# Altium schematic sheet Connecteurs.SchDoc: Connecteurs
size A4; ApprovedBy: Baptiste GADEBILLE; CheckedBy: Baptiste GADEBILLE; Author: Clément MANANT; DrawnBy: Clément MANANT; Revision: V1.0 Rev A; SheetNumber: 3; SheetTotal: 5
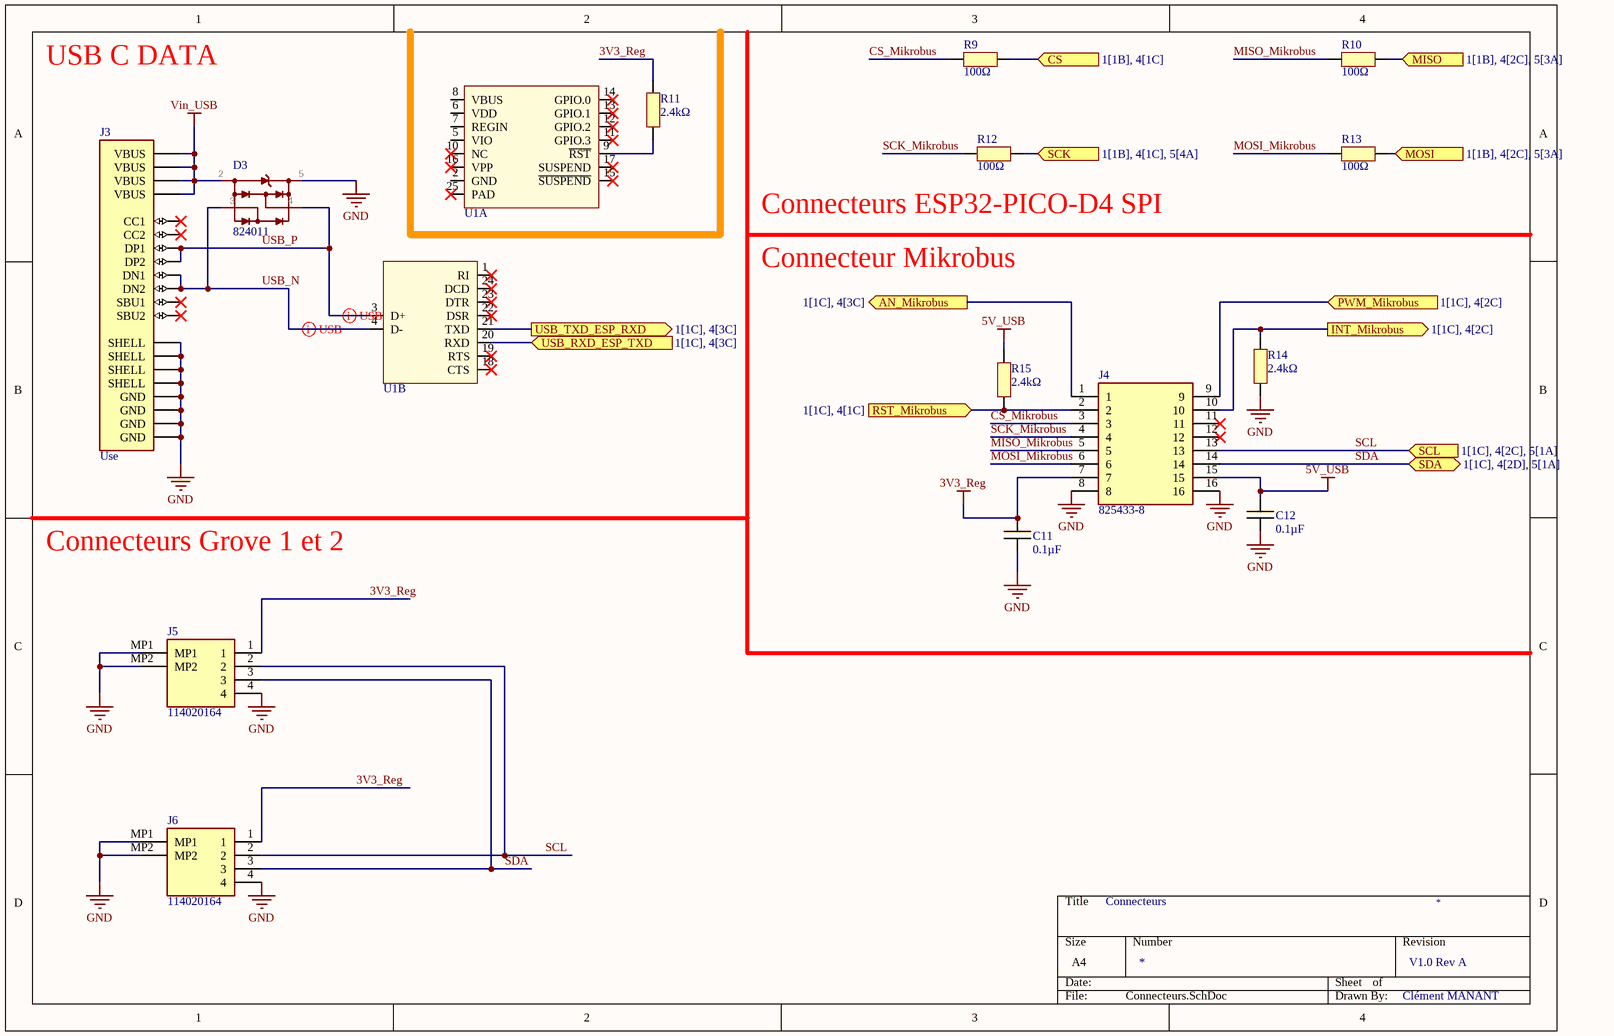
[diagram p0: Connecteurs.SchDoc]

## Parts
C11  0.1µF  [CAPC1005X06N]
C12  0.1µF  [CAPC1005X06N]
D3  824011  [824011]
J3  Use  [USB4085-GF-A]
J4  825433-8  [Connect-Mikronus]
J5  114020164  [114020164]
J6  114020164  [114020164]
R9  100Ω  [RESC1005X06N]
R10  100Ω  [RESC1005X06N]
R11  2.4kΩ  [RESC1005X06N]
R12  100Ω  [RESC1005X06N]
R13  100Ω  [RESC1005X06N]
R14  2.4kΩ  [RESC1005X06N]
R15  2.4kΩ  [RESC1005X06N]
U1  CP2104-F03-GM  [PQFN50P400X400X80_HS-25N]  (value not drawn)  (parts A,B of 2)

## Ports
AN_Mikrobus (out, see 1[1C], 4[3C]), CS (in, see 1[1B], 4[1C]), INT_Mikrobus (out, see 1[1C], 4[2C]), MISO (in, see 1[1B], 4[2C], 5[3A]), MOSI (in, see 1[1B], 4[2C], 5[3A]), PWM_Mikrobus (in, see 1[1C], 4[2C]), RST_Mikrobus (in, see 1[1C], 4[1C]), SCK (in, see 1[1B], 4[1C], 5[4A]), SCL (in, see 1[1C], 4[2C], 5[1A]), SDA (bidir, see 1[1C], 4[2D], 5[1A]), USB_RXD_ESP_TXD (in, see 1[1C], 4[3C]), USB_TXD_ESP_RXD (out, see 1[1C], 4[3C])

## Nets
3V3_Reg: C11.1 J4.7 J5.1 J6.1 R11.2
5V_USB: C12.1 J4.15 R15.2
GND: C11.2 C12.2 D3.5(VDD) J3.A1(GND) J3.A12(GND) J3.B1(GND) J3.B12(GND) J3.S1(SHELL) J3.S2(SHELL) J3.S3(SHELL) J3.S4(SHELL) J4.8 J4.16 J5.4 J5.MP1 J5.MP2 J6.4 J6.MP1 J6.MP2 R14.1
Vin_USB: D3.2(GND) J3.A4(VBUS) J3.A9(VBUS) J3.B4(VBUS) J3.B9(VBUS)
AN_Mikrobus: J4.1 ; port AN_Mikrobus
CS: R9.2 ; port CS
CS_Mikrobus: J4.3 R9.1
INT_Mikrobus: J4.10 R14.2 ; port INT_Mikrobus
MISO: R10.2 ; port MISO
MISO_Mikrobus: J4.5 R10.1
MOSI: R13.2 ; port MOSI
MOSI_Mikrobus: J4.6 R13.1
PWM_Mikrobus: J4.9 ; port PWM_Mikrobus
RST_Mikrobus: J4.2 R15.1 ; port RST_Mikrobus
SCK: R12.2 ; port SCK
SCK_Mikrobus: J4.4 R12.1
SCL: J4.13 J5.2 J6.2 ; port SCL
SDA: J4.14 J5.3 J6.3 ; port SDA
USB_N: D3.3 J3.A7(DN1) J3.B7(DN2) U1.4(D-)
USB_P: D3.4 J3.A6(DP1) J3.B6(DP2) U1.3(D+)
USB_RXD_ESP_TXD: U1.20(RXD) ; port USB_RXD_ESP_TXD
USB_TXD_ESP_RXD: U1.21(TXD) ; port USB_TXD_ESP_RXD
NetR11_1: R11.1 U1.9(~{RST})

Not connected (* = marked no-connect by the designer): J3 A5(CC1)* A8(SBU1)* B5(CC2)* B8(SBU2)*; J4 11* 12*; U1 1(RI)* 2(GND) 5(VIO) 6(VDD) 7(REGIN) 8(VBUS) 10(NC)* 11(GPIO.3)* 12(GPIO.2)* 13(GPIO.1)* 14(GPIO.0)* 15(~{SUSPEND})* 16(VPP)* 17(SUSPEND)* 18(CTS)* 19(RTS)* 22(DSR)* 23(DTR)* 24(DCD)* 25(PAD)*

## Layout directives
differential pair: USB_N, USB_P

## Notes on the sheet
- USB C DATA
- (near R12) Connecteurs ESP32-PICO-D4 SPI
- Connecteur Mikrobus
- Connecteurs Grove 1 et 2

## Library data of the parts
C11 C12 = Capacitor
D3 = 824011: TVS Diode Array WE-TVS, High Speed Series  - Low capazity - No leakage current - Low clamping voltage - high ESD voltage protection  -- USB 1.0 - 2.0
J3 = USB4085-GF-A: Connecteurs USB USB Type C, 2.0, Rec, TH , G/F, RA , Top Mnt, T & R
J4 = Connect-Mikrobus: Headers & Wire Housings 8P double for connection mikrobus; Manufacturer_Name: TE Connectivity; Manufacturer_Part_Number: 825433-8; Mouser Part Number: 571-825433-8
J5 J6 = 114020164: Seeed Studio Accessories Grove Female Header - SMD-4P-2.0mm-90D-20Pcs; Manufacturer_Name: Seeed Studio; Manufacturer_Part_Number: 114020164; Mouser Part Number: 713-114020164
R9-R15 = Resistor
U1 = USBBridge: USB Bridge, USB to UART USB 2.0 UART Interface 24-QFN (4x4); Manufacturer 1: Silicon Labs; Supplier 1: Arrow Electronics; Supplier Part Number 1: CP2104-F03-GM; Manufacturer Part Number 1: CP2104-F03-GM